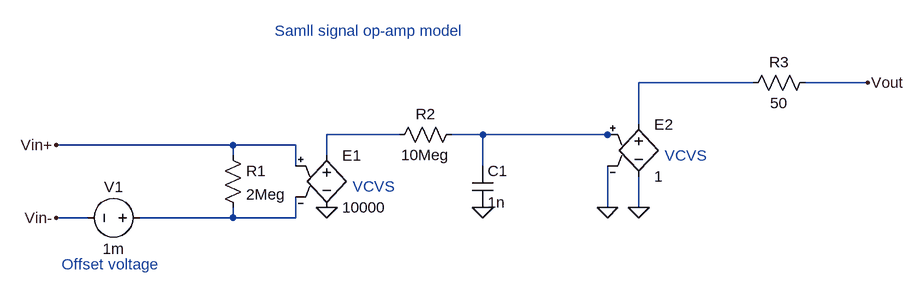
[diagram p0: schematic OP_AMP_MODEL_SMALL_SIGNAL.asc]
OP_AMP_MODEL_SMALL_SIGNAL.asc, the LTspice schematic file:
Version 4.1
SHEET 1 1000 680
WIRE 752 0 576 0
WIRE 928 0 832 0
WIRE 576 64 576 0
WIRE 208 80 96 80
WIRE 336 80 288 80
WIRE 528 80 336 80
WIRE 544 80 528 80
WIRE -48 96 -320 96
WIRE 48 96 -48 96
WIRE -48 112 -48 96
WIRE 96 112 96 80
WIRE 48 128 48 96
WIRE 336 128 336 80
WIRE 528 192 528 128
WIRE 576 192 576 144
WIRE -272 208 -320 208
WIRE -48 208 -48 192
WIRE -48 208 -192 208
WIRE 48 208 48 176
WIRE 48 208 -48 208
FLAG 96 192 0
FLAG 336 192 0
FLAG 528 192 0
FLAG 576 192 0
FLAG 928 0 Vout
FLAG -320 96 Vin+
FLAG -320 208 Vin-
SYMBOL e 96 96 R0
SYMATTR InstName E1
SYMATTR Value 10000
SYMBOL e 576 48 R0
SYMATTR InstName E2
SYMATTR Value 1
SYMBOL res -64 96 R0
SYMATTR InstName R1
SYMATTR Value 2Meg
SYMBOL voltage -176 208 R90
WINDOW 0 -32 56 VBottom 2
WINDOW 3 32 56 VTop 2
WINDOW 123 0 0 Left 0
WINDOW 39 0 0 Left 0
SYMATTR InstName V1
SYMATTR Value 1m
SYMBOL res 304 64 R90
WINDOW 0 0 56 VBottom 2
WINDOW 3 32 56 VTop 2
SYMATTR InstName R2
SYMATTR Value 10Meg
SYMBOL cap 320 128 R0
SYMATTR InstName C1
SYMATTR Value 1n
SYMBOL res 848 -16 R90
WINDOW 0 0 56 VBottom 2
WINDOW 3 32 56 VTop 2
SYMATTR InstName R3
SYMATTR Value 50
TEXT 136 160 Left 2 ;VCVS
TEXT 616 112 Left 2 ;VCVS
TEXT 16 -80 Left 2 ;Samll signal op-amp model
TEXT -312 280 Left 2 ;Offset voltage

The netlist it stands for:
* OP_AMP_MODEL_SMALL_SIGNAL.asc
E1 N002 0 Vin+ N004 10000
E2 N001 0 N003 0 1
R1 Vin+ N004 2Meg
V1 N004 Vin- 1m
R2 N003 N002 10Meg
C1 N003 0 1n
R3 Vout N001 50
* VCVS
* VCVS
* Samll signal op-amp model
* Offset voltage
.backanno
.end